# EAGLE design motorspeed (EAGLE 9.4.2)
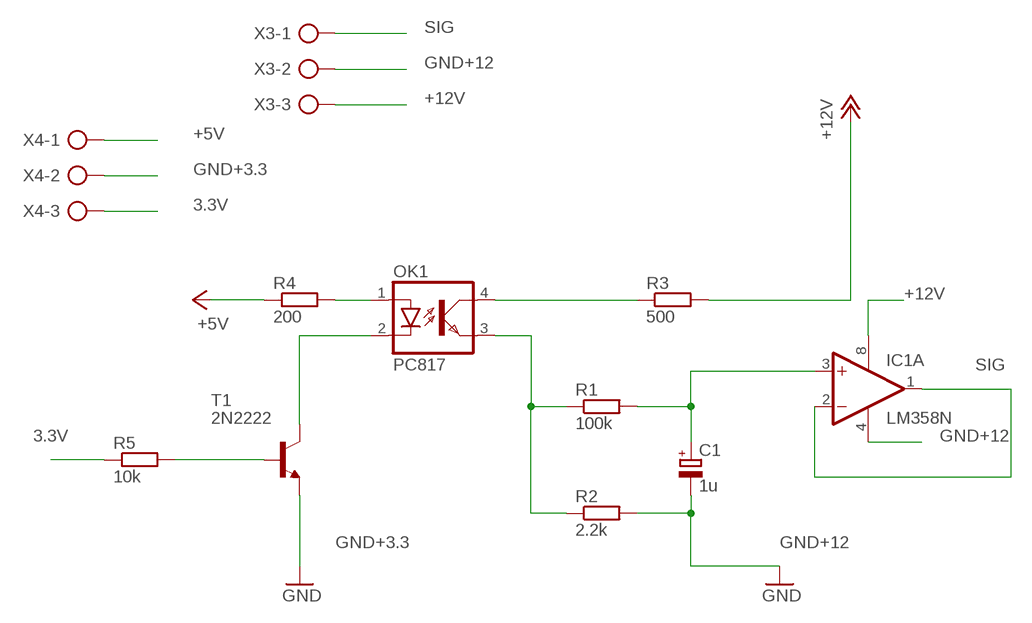
[diagram p0: schematic, sheet 1]

## Parts
C1  1u  CPOL-EUE2-5  [E2-5]
IC1  LM358N  [DIL08]
OK1  PC817  [DIL04]
R1  100k  R-EU_0207/12  [0207/12]
R2  2.2k  R-EU_0207/12  [0207/12]
R3  500  R-EU_0207/12  [0207/12]
R4  200  R-EU_0207/12  [0207/12]
R5  10k  R-EU_0207/12  [0207/12]
T1  2N2222  [TO18]
X3  AK500/3-H  [AK500/3-H]
X4  AK500/3-H  [AK500/3-H]

## Nets
3.3V: R5.1 X4.3
+5V: R4.1 X4.1
+12V: IC1.8(P:V+) R3.2 X3.3
GND+3.3: T1.1(E) X4.2 ; supply symbol labelled GND
GND+12: C1.- IC1.4(P:V-) R2.2 X3.2 ; supply symbol labelled GND
N$1: OK1.4(COL) R3.1
N$2: OK1.3(EMIT) R1.1 R2.1
N$3: C1.+ IC1.3(A:+IN) R1.2
N$6: OK1.2(C) T1.3(C)
N$7: R5.2 T1.2(B)
N$8: OK1.1(A) R4.2
SIG: IC1.1(A:OUT) IC1.2(A:-IN) X3.1
Unconnected: IC1.5(B:+IN) IC1.6(B:-IN) IC1.7(B:OUT)

## Library data of the parts
C1 = rcl:CPOL-EU: POLARIZED CAPACITOR, European symbol; SPICEPREFIX: C
IC1 = linear:LM358: OP AMP also LM158; LM258; LM2904 Source: http://cache.national.com/ds/LM/LM158.pdf
OK1 = optocoupler:PC817: SHARP OPTO COUPLER; MPN: PC817X4J000F; OC_FARNELL: 9707727; OC_NEWARK: 97K7059
R1-R5 = rcl:R-EU_: RESISTOR, European symbol; SPICEPREFIX: R
T1 = transistor:2N2222: NPN TRANSISTOR
X3 X4 = con-ptr500:AK500/3-H: CONNECTOR Aug. 2004 / PTR Meßtechnik: Die Bezeichnung der Serie AK505 wurde geändert. Es handelt sich hierbei um AK500 in horizontaler Ausführung.; OC_FARNELL: unknown; OC_NEWARK: unknown

## Board
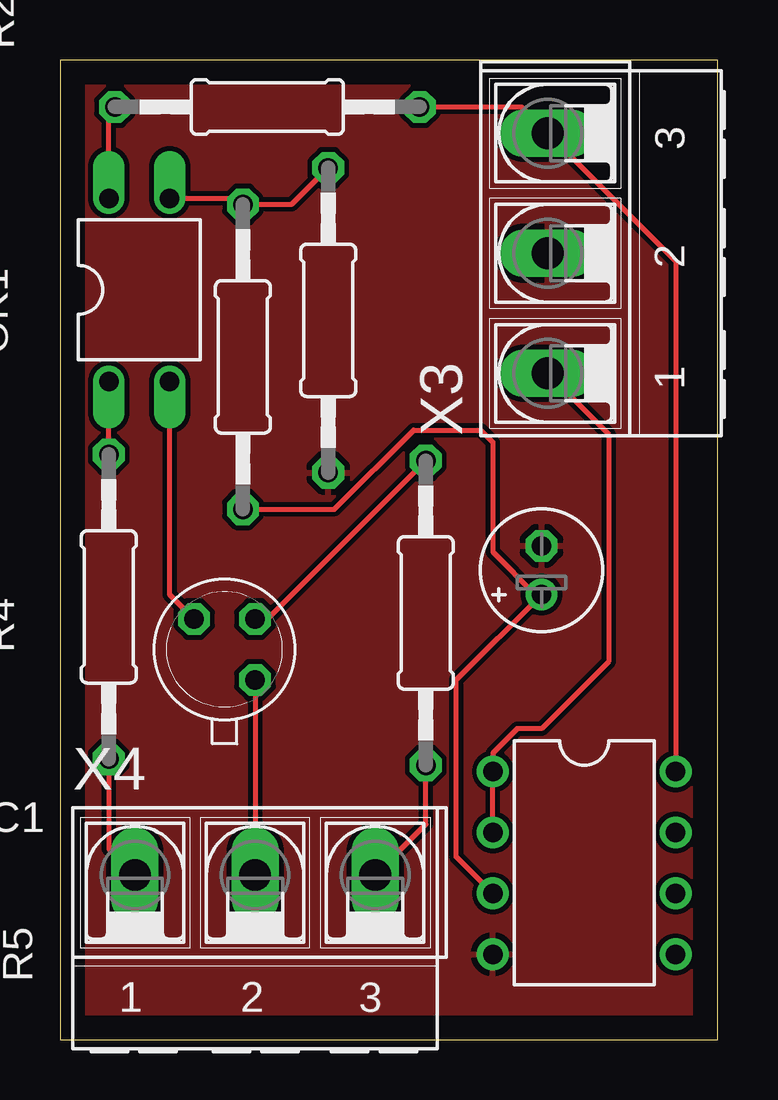
[diagram p1: board, top side]
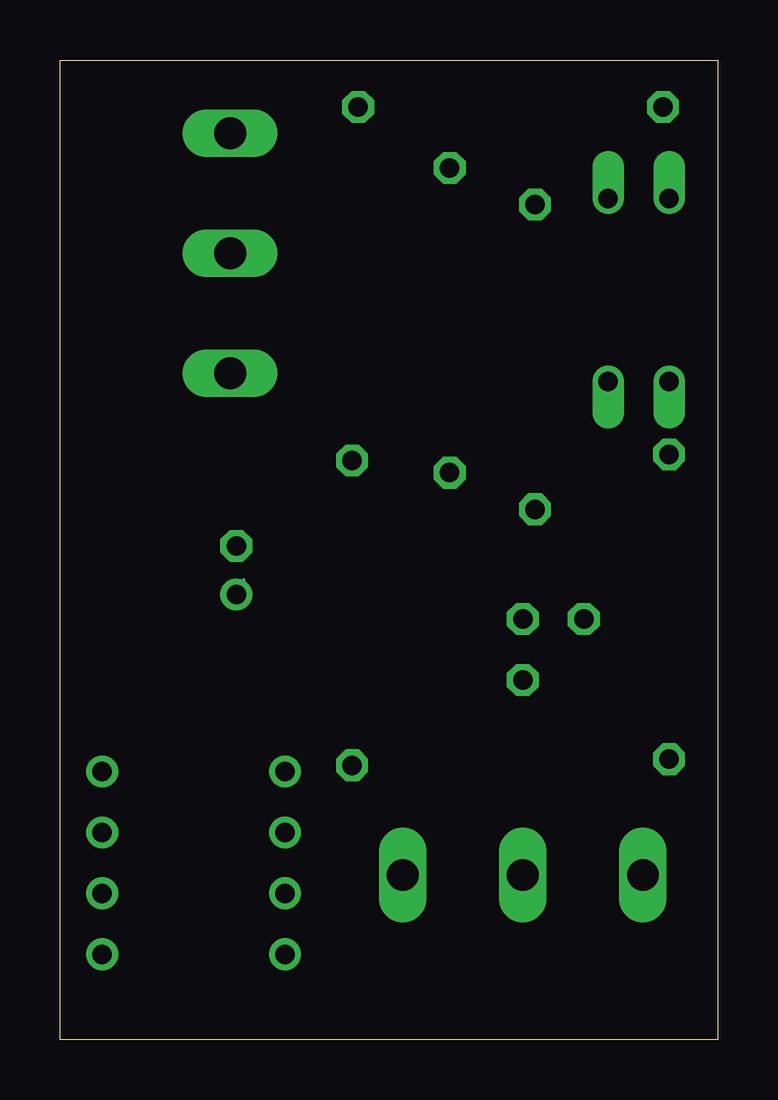
[diagram p2: board, bottom side, seen from below]

Size 27.41 x 40.82 mm. Coordinates in mm from the lower left corner, seen from the top.
Outline: 0,0 27.41,0 27.41,40.82 0,40.82 0,0
Copper layers (1*16): Top 0.035mm / dielectric 1.5mm / Bottom 0.035mm
Design rules "default *": minimum track width 6mil, minimum drill 0.35mm, track to track 8mil, track to pad 8mil, pad to pad 8mil, via to via 8mil, smd to smd 8mil, copper to edge 40mil, drill to drill 6mil, minimum pad ring 10mil, minimum via ring 8mil, stop-mask expansion 4mil, vias tented up to drill 0mil, thermal gap 10mil

### Footprints (pad centres in the part's own frame; a part is rotated, then mirrored left to right if it is on the bottom)
E2-5 = drill 0.813 pad 1.27: + -1.016,0 | drill 0.813 pad 1.27 octagon: - 1.016,0
DIL08 = drill 0.813 pad 1.27: 1 -3.81,-3.81; 2 -1.27,-3.81; 3 1.27,-3.81; 4 3.81,-3.81; 5 3.81,3.81; 6 1.27,3.81; 7 -1.27,3.81; 8 -3.81,3.81
DIL04 = drill 0.813 offset: 1 -1.27,-3.81; 2 1.27,-3.81; 3 1.27,3.81; 4 -1.27,3.81
0207/12 = drill 0.813 octagon: 1 -6.35,0; 2 6.35,0
TO18 = drill 0.813 octagon: 1 -1.27,-1.27; 2 1.27,-1.27; 3 1.27,1.27
AK500/3-H = drill 1.321 long: 1 -5.004,0; 2 0,0; 3 5.004,0

### Placement (x,y rotation side)
C1  20.07,19.56 90 top
IC1  21.84,7.37 270 top
OK1  3.3,31.24 0 top
R1  7.62,28.45 270 top
R2  11.18,29.97 270 top
R3  8.64,38.86 0 top
R4  2.03,18.03 90 top
R5  15.24,17.78 90 top
T1  6.86,16.26 90 top
X3  20.32,32.77 90 top
X4  8.13,6.86 0 top

### Tracks (layer width: path | path; a pad name or v marks a point on that pad's centre or on a via)
3.3V
  Top 0.203: X4.3 15.24,8.97 R5.1
+5V
  Top 0.203: R4.1 2.03,7.95 X4.1
+12V
  Top 0.203: R3.2 19.23,38.86 X3.3 25.65,32.44 IC1.8
GND+3.3
  Top 0.203: T1.1 X4.2
GND+12
  Top 0.152: R2.2 11.32,23.64
  pour Top: 0,41.15 0,-0.25 27.69,-0.25 27.69,41.15
N$1
  Top 0.203: OK1.4 2.03,38.61 R3.1
N$2
  Top 0.203: R2.1 9.65,34.8 R1.1 7.37,35.05 OK1.3
N$3
  Top 0.203: R1.2 11.43,22.1 14.73,25.4 17.53,25.4 18.03,24.89 18.03,20.32 19.81,18.54 C1.+ 16.51,14.99 16.51,7.62 IC1.3
  Bottom 0.152: 19.76,19.15 C1.+
N$6
  Top 0.203: T1.3 4.57,18.54 OK1.2
N$7
  Top 0.203: R5.2 8.64,17.53 T1.2
N$8
  Top 0.203: R4.2 OK1.1
SIG
  Top 0.203: IC1.2 IC1.1 18.03,11.94 19.05,12.95 20.07,12.95 22.86,15.75 22.86,25.22 X3.1